# EAGLE design AVR-Pocket-Programmer (EAGLE 6.5.0)
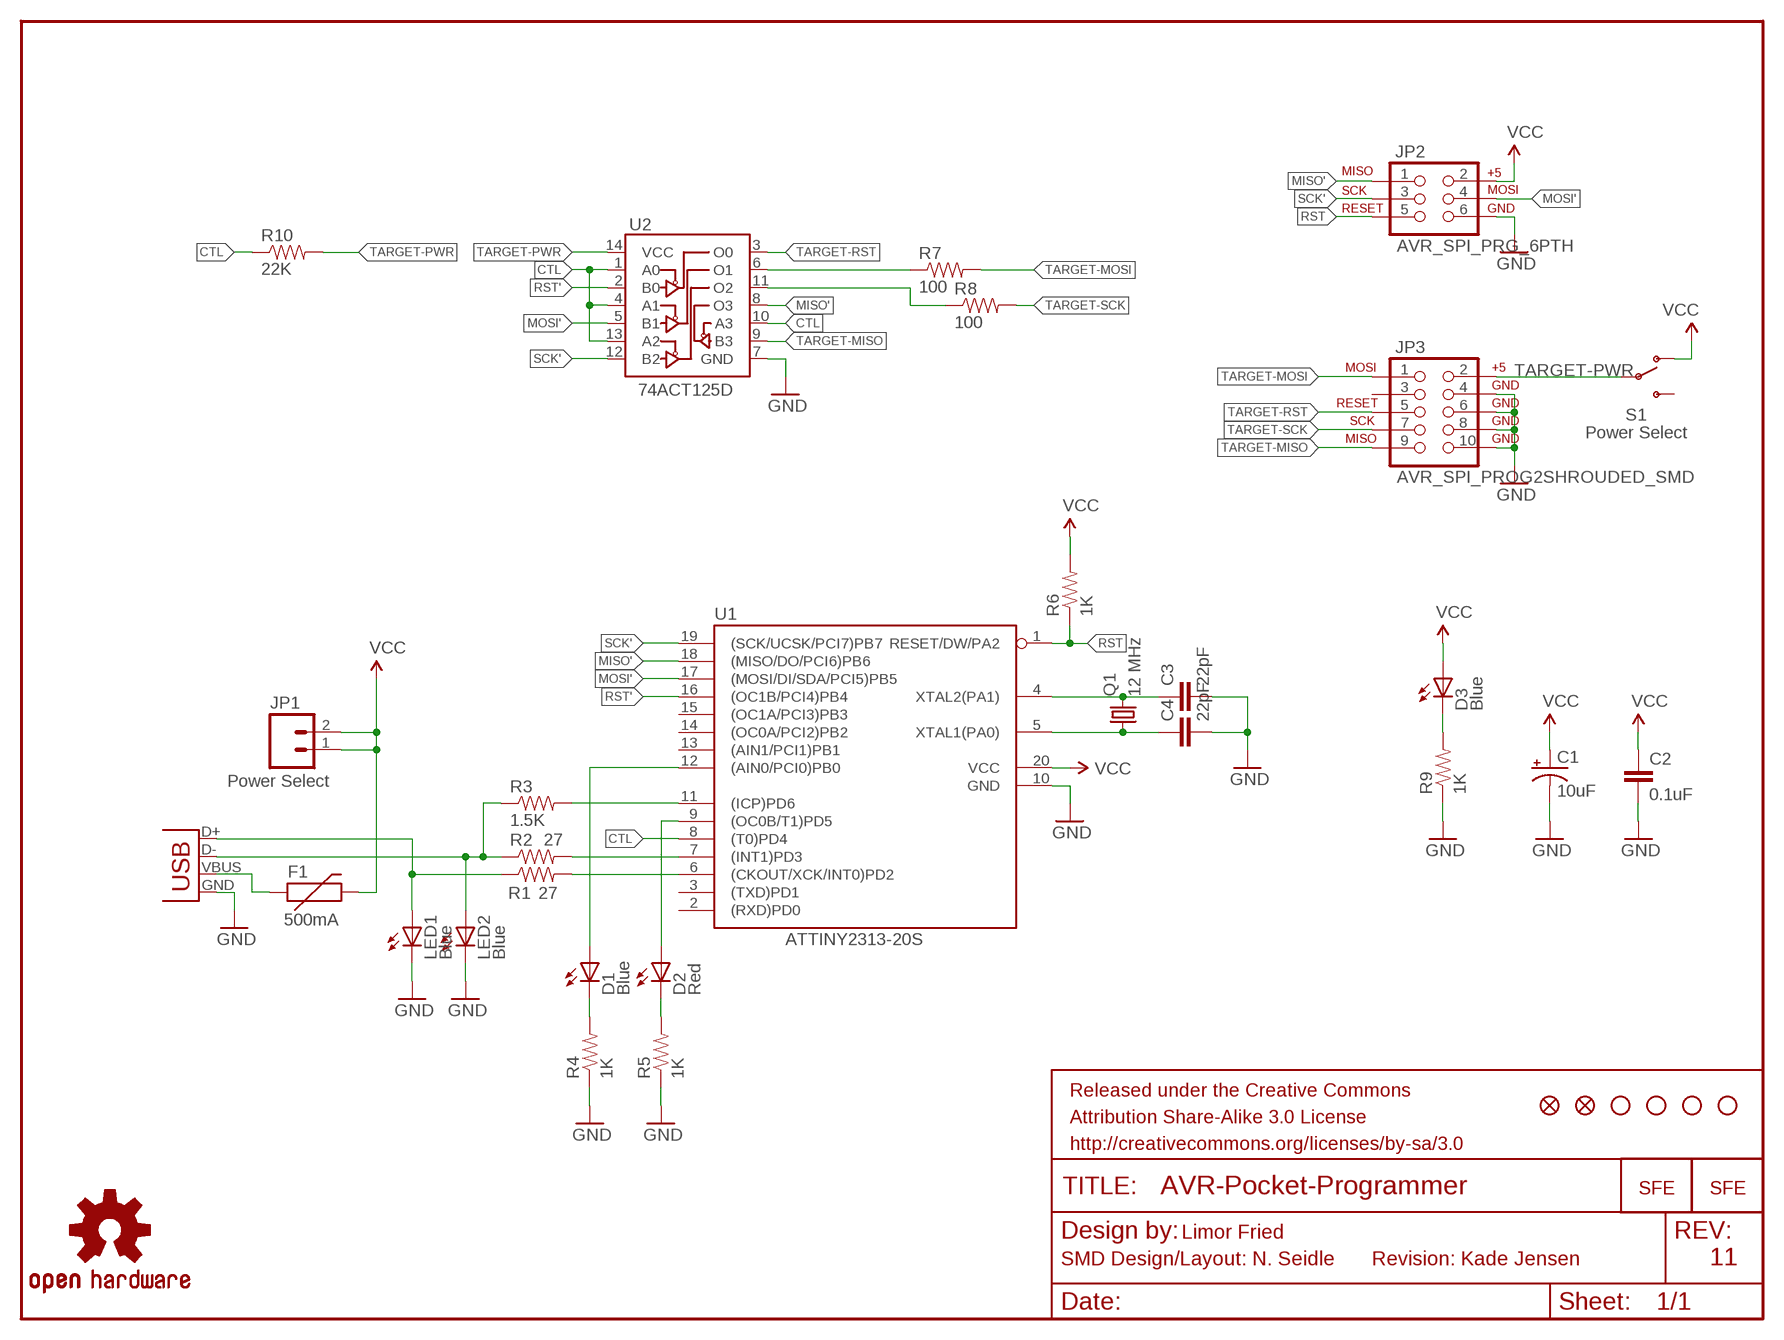
[diagram p0: schematic, sheet 1]

## Parts
C1  10uF  CAP_POL1206  [EIA3216]
C2  0.1uF  CAP0603-CAP  [0603-CAP]
C3  22pF  CAP0603-CAP  [0603-CAP]
C4  22pF  CAP0603-CAP  [0603-CAP]
D1  Blue  LED0603  [LED-0603]
D2  Red  LED0603  [LED-0603]
D3  Blue  LED0603  [LED-0603]
F1  500mA  PTCSMD-W  [PTC-1206-WIDE]
FRAME1  FRAME-LETTER  [CREATIVE_COMMONS]
JP1  Power Select  M02PTH  [1X02]
JP2  AVR_SPI_PRG_6PTH  [2X3]
JP3  AVR_SPI_PROG2SHROUDED_SMD  [2X5-SHROUDED_SMD]
LED1  Blue  LED0603  [LED-0603]
LED2  Blue  LED0603  [LED-0603]
LOGO1  OSHW-LOGOM  [OSHW-LOGO-M]
Q1  12 MHz  CRYSTAL5X3  [CRYSTAL-SMD-5X3]
R1  27  RESISTOR0603-RES  [0603-RES]
R2  27  RESISTOR0603-RES  [0603-RES]
R3  1.5K  RESISTOR0603-RES  [0603-RES]
R4  1K  RESISTOR0603-RES  [0603-RES]
R5  1K  RESISTOR0603-RES  [0603-RES]
R6  1K  RESISTOR0603-RES  [0603-RES]
R7  100  RESISTOR0603-RES  [0603-RES]
R8  100  RESISTOR0603-RES  [0603-RES]
R9  1K  RESISTOR0603-RES  [0603-RES]
R10  22K  RESISTOR0603-RES  [0603-RES]
S1  Power Select  SWITCH-SPSTSMD  [AYZ0202]
U1  ATTINY2313-20S  [SO20L]
U2  74ACT125D  [SO014]
U$1  STAND-OFF  [STAND-OFF]
U$2  LOGO-SFESK  [SFE-LOGO-FLAME]
U$3  STAND-OFF  [STAND-OFF]
U$4  STAND-OFF  [STAND-OFF]
U$5  STAND-OFF  [STAND-OFF]
U$6  FIDUCIAL1X2  [FIDUCIAL-1X2]
U$7  FIDUCIAL1X2  [FIDUCIAL-1X2]
U$8  LOGO-SFENEW  [SFE-NEW-WEBLOGO]
X2  USBSMD  [USB-MINIB]

## Nets
CTL: R10.1 U1.8((T0)PD4) U2.1(A0) U2.4(A1) U2.10(A3) U2.13(A2)
D+: LED1.A R1.1 X2.D+
D-: LED2.A R2.1 R3.1 X2.D-
GND: C1.C(-) C2.2 C3.2 C4.2 JP2.6 JP3.4 JP3.6 JP3.8 JP3.10 LED1.C LED2.C R4.1 R5.1 R9.1 U1.10(GND) U2.7(GND) X2.GND
MISO': JP2.1 U1.18((MISO/DO/PCI6)PB6) U2.8(O3)
MOSI': JP2.4 U1.17((MOSI/DI/SDA/PCI5)PB5) U2.5(B1)
N$1: R3.2 U1.11((ICP)PD6)
N$2: D2.A U1.9((OC0B/T1)PD5)
N$3: D3.C R9.2
N$4: F1.1 X2.VBUS
N$5: C3.1 Q1.3 U1.4(XTAL2(PA1))
N$6: C4.1 Q1.1 U1.5(XTAL1(PA0))
N$17: D1.A U1.12((AIN0/PCI0)PB0)
N$18: D1.C R4.2
N$19: D2.C R5.2
N$22: R7.1 U2.6(O1)
N$25: R8.1 U2.11(O2)
PD+: R1.2 U1.6((CKOUT/XCK/INT0)PD2)
PD-: R2.2 U1.7((INT1)PD3)
RST: JP2.5 R6.1 U1.1(RESET/DW/PA2)
RST': U1.16((OC1B/PCI4)PB4) U2.2(B0)
SCK': JP2.3 U1.19((SCK/UCSK/PCI7)PB7) U2.12(B2)
TARGET-MISO: JP3.9 U2.9(B3)
TARGET-MOSI: JP3.1 R7.2
TARGET-PWR: JP3.2 R10.2 S1.2(P) U2.14(VCC)
TARGET-RST: JP3.5 U2.3(O0)
TARGET-SCK: JP3.7 R8.2
VCC: C1.A(+) C2.1 D3.A F1.2 JP1.1 JP1.2 JP2.2 R6.2 S1.1(O) U1.20(VCC)
Unconnected: JP3.3 S1.3(S) U1.2((RXD)PD0) U1.3((TXD)PD1) U1.13((AIN1/PCI1)PB1) U1.14((OC0A/PCI2)PB2) U1.15((OC1A/PCI3)PB3)

## Notes on the sheet
- Limor Fried
- SMD Design/Layout: N. Seidle | Revision: Kade Jensen | 11

## Library data of the parts
C1 = SparkFun:CAP_POL: Capacitor Polarized These are standard SMD and PTH capacitors. Normally 10uF, 47uF, and 100uF in electrolytic and tantalum varieties. Always verify the external diameter of the through hole cap, it varies with capacity, voltage, and manufacturer. The EIA devices should be standard.
C2-C4 = SparkFun:CAP: Capacitor Standard 0603 ceramic capacitor, and 0.1" leaded capacitor.
D1-D3 LED1 LED2 = SparkFun:LED: LEDs Standard schematic elements and footprints for 5mm, 3mm, 1206, and 0603 sized LEDs. 5mm - Spark Fun Electronics SKU : COM-00529 (and others)
F1 = SparkFun-PowerIC:PTC: Resettable Fuse PTC Resettable Fuse. Spark Fun Electronics SKU : COM-08357
FRAME1 = SparkFun-Aesthetics:FRAME-LETTER: Schematic Frame Standard 8.5x11 US Letter frame
JP1 = SparkFun:M02: Header 2 Standard 2-pin 0.1" header. Use with straight break away headers (SKU : PRT-00116), right angle break away headers (PRT-00553), swiss pins (PRT-00743), machine pins (PRT-00117), and female headers (PRT-00115). Molex polarized connector foot print use with SKU : PRT-08233 with associated crimp pins and housings.
JP2 = SparkFun:AVR_SPI_PRG_6: AVR ISP 6 Pin This is the reduced ISP connector for AVR programming. Common on Arduino. This footprint will take up less PCB space and can be used with a 10-pin to 6-pin adapter such as SKU: BOB-08508
JP3 = SparkFun:AVR_SPI_PROG2: AVR ICSP Header This is the standard AVR In Circuit Serial Programming header. Minimal, but includes pin one indicator. Works with standard Olimex programmers. Also look for the 6-pin reduced version. Spark Fun Electronics SKU: PRT-00778. Note that the Variant "Shrouded_SMD" is an SMD part and will not work with the thru-hole connector.
LOGO1 = SparkFun-Aesthetics:OSHW-LOGO: Open Source Hardware Logo This logo indicates the piece of hardware it is found on incorporates a OSHW license and/or adheres to the definition of open source hardware found here: http://freedomdefined.org/OSHW
Q1 = SparkFun:CRYSTAL: Crystals Various standard crystals. Proven footprints. Spark Fun Electronics SKU : COM-00534
R1-R10 = SparkFun:RESISTOR: Resistor Basic schematic elements and footprints for 0603, 1206, and PTH 1/10th watt (small) resistors.
S1 = SparkFun:SWITCH-SPST: SPST Switch Simple slide switch. Spark Fun Electronics SKU : COM-00102
U1 = avr:ATTINY2313: MICROCONTROLLER 2 Kbytes FLASH 128 bytes SRAM 128 bytes EEPROM USART USI
U2 = SparkFun:74ACT125D: Quad Buffer with 3-State Outputs- ON Semi Conductor: Digikey P/N MC74ACT125DR2GOSTR-ND
U$1 U$3-U$5 = SparkFun:STAND-OFF: Stand Off This is the mechanical footprint for a #4 phillips button head screw. Use the keepout ring to avoid running the screw head into surrounding components. SKU : PRT-00447
U$2 U$8 = SparkFun:LOGO-SFE: Spark Fun Electronics PCB Logo This is the standard Spark Fun Electronics PCB logo.
U$6 U$7 = SparkFun:FIDUCIAL: Fiducial Alignment Points Various fiducial points for machine vision alignment.
X2 = SparkFun:USB: USB Connectors USB-B-PTH is fully proven SKU : PRT-00139 USB-miniB is fully proven SKU : PRT-00587 USB-A-PCB is untested. USB-A-H is throughly reviewed, but untested. Spark Fun Electronics SKU : PRT-00437 USB-B-SMT is throughly reviewed, but untested. Needs silkscreen touching up. USB-A-S has not been used/tested USB-MB-H has not been used/tested

## Net classes
0 default: width 0.203 mm, drill 0.508 mm, clearance 0.203 mm

## Board
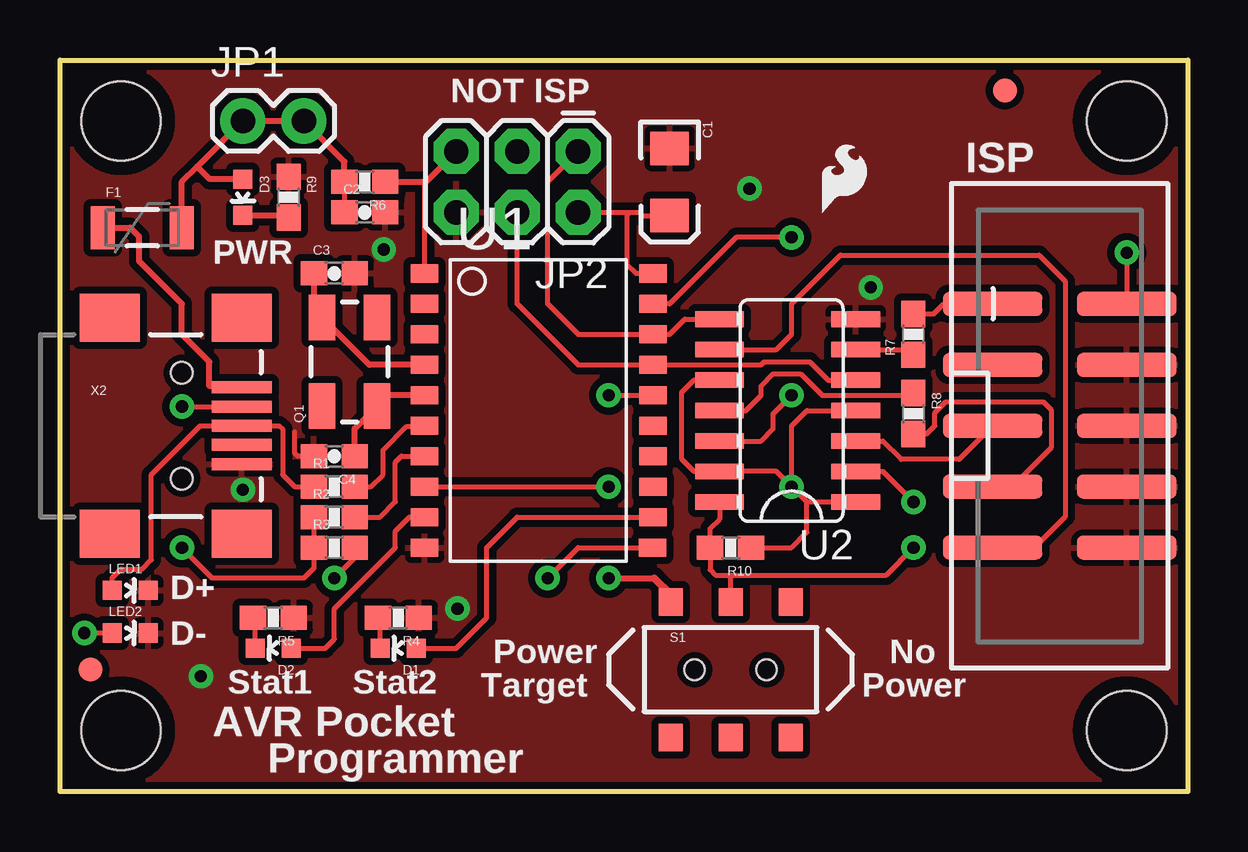
[diagram p1: board, top side]
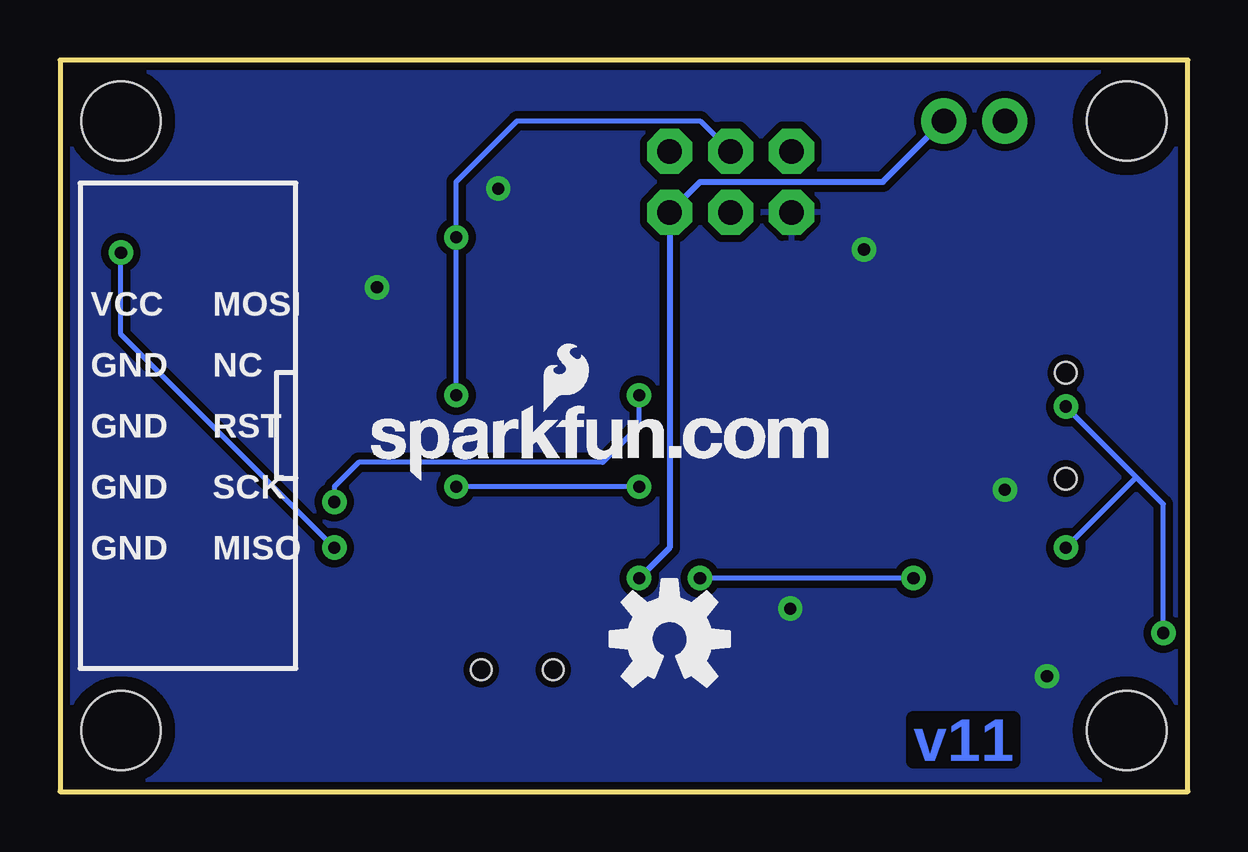
[diagram p2: board, bottom side, seen from below]

Size 46.99 x 30.48 mm. Coordinates in mm from the lower left corner, seen from the top.
Outline: 0,30.48 46.99,30.48 46.99,0 0,0 0,30.48
Copper layers (1*16): Top 0.035mm / dielectric 1.5mm / Bottom 0.035mm
Design rules "SparkFun": minimum track width 8mil, minimum drill 20mil, track to track 8mil, track to pad 8mil, pad to pad 8mil, via to via 8mil, smd to smd 8mil, copper to edge 10mil, drill to drill 8mil, minimum pad ring 12mil, minimum via ring 10mil, stop-mask expansion 4mil, vias tented up to drill 20mil, thermal gap 10mil

### Footprints (pad centres in the part's own frame; a part is rotated, then mirrored left to right if it is on the bottom)
EIA3216 = smd 1.4 x 1.6: A 1.4,0; C -1.4,0
0603-CAP = smd 1.1 x 1: 1 -0.85,0; 2 0.85,0
LED-0603 = smd 0.8 x 0.8: A 0,-0.75; C 0,0.75
PTC-1206-WIDE = smd 1 x 1.8: 1 -1.654,0; 2 1.654,0
1X02 = drill 1.016 pad 1.88: 1 0,0; 2 2.54,0
2X3 = drill 1.016 pad 1.88 octagon: 1 0,0; 2 0,2.54; 3 2.54,0; 4 2.54,2.54; 5 5.08,0; 6 5.08,2.54
2X5-SHROUDED_SMD = smd 4.15 x 1: 1 -2.794,5.08; 2 2.794,5.08; 3 -2.794,2.54; 4 2.794,2.54; 5 -2.794,0; 6 2.794,0; 7 -2.794,-2.54; 8 2.794,-2.54; 9 -2.794,-5.08; 10 2.794,-5.08
CRYSTAL-SMD-5X3 = smd 1.9 x 1.1: 1 -1.85,-1.15; 2 1.85,-1.15; 3 1.85,1.15; 4 -1.85,1.15
0603-RES = smd 1.1 x 1: 1 -0.85,0; 2 0.85,0
AYZ0202 = smd 1 x 1.15: 1 -2.5,2.825; 2 0,2.825; 3 2.5,2.825; 4 -2.5,-2.825; 5 0,-2.825; 6 2.5,-2.825 | hole 0.85: 1.5,0; -1.5,0
SO20L = smd 0.762 x 1.143: 1 -5.08,-5.131; 2 -3.81,-5.131; 3 -2.54,-5.131; 4 -1.27,-5.131; 5 0,-5.131; 6 1.27,-5.131; 7 2.54,-5.131; 8 3.81,-5.131; 9 5.08,-5.131; 10 6.35,-5.131; 11 6.35,4.369; 12 5.08,4.394; 13 3.81,4.394; 14 2.54,4.394; 15 1.27,4.394; 16 0,4.394; 17 -1.27,4.394; 18 -2.54,4.394; 19 -3.81,4.394; 20 -5.08,4.394
SO014 = smd 0.66 x 2.032: 1 -3.175,-2.68; 2 -1.905,-2.68; 3 -0.635,-2.68; 4 0.635,-2.68; 5 1.905,-2.68; 6 3.175,-2.68; 7 4.445,-2.68; 8 4.445,2.997; 9 3.175,2.997; 10 1.905,2.997; 11 0.635,2.997; 12 -0.635,2.997; 13 -1.905,2.997; 14 -3.175,2.997
STAND-OFF = hole 3.302: 0,0
FIDUCIAL-1X2 = smd 1 x 1: 1 0,0
USB-MINIB = smd 2.5 x 0.5: D+ 2.5,0; D- 2.5,0.8; GND 2.5,-1.6; ID 2.5,-0.8; VBUS 2.5,1.6 | smd 2.5 x 2: GND@1 -3,-4.5; GND@2 -3,4.5; GND@3 2.5,4.5; GND@4 2.5,-4.5 | hole 0.9: 0,2.2; 0,-2.2

### Placement (x,y rotation side)
C1  25.4,25.4 270 top
C2  12.7,24.13 0 top
C3  11.43,21.59 0 top
C4  11.43,13.97 180 top
D1  14.1,5.97 90 top
D2  8.89,5.97 90 top
D3  7.62,24.77 180 top
F1  3.43,23.5 0 top
FRAME1  1.27,-11.43 0 top  (outside the outline)
JP1  7.62,27.94 0 top
JP2  21.59,26.67 180 top
JP3  41.66,15.24 0 top
LED1  2.92,8.38 270 top
LED2  2.92,6.6 270 top
LOGO1  21.59,6.35 0 bottom
Q1  12.06,17.91 90 top
R1  11.43,12.7 0 top
R2  11.43,11.43 0 top
R3  11.43,10.16 0 top
R4  14.1,7.24 180 top
R5  8.89,7.24 180 top
R6  12.7,25.4 180 top
R7  35.56,19.05 90 top
R8  35.56,15.75 270 top
R9  9.53,24.77 270 top
R10  27.94,10.16 180 top
S1  27.94,5.08 0 top
U1  20.32,16.51 270 top
U2  30.48,15.24 90 top
U$1  2.54,2.54 0 top
U$2  31.75,24.13 0 top
U$3  2.54,27.94 0 top
U$4  44.45,27.94 0 top
U$5  44.45,2.54 0 top
U$6  1.27,5.08 0 top
U$7  39.37,29.21 0 top
U$8  34.04,12.95 0 bottom
X2  5.08,15.24 0 top

### Tracks (layer width: path | path; a pad name or v marks a point on that pad's centre or on a via)
CTL  (via drill 0.51)
  Top 0.203: 31.11,12.06 U2.1 | v30.48,12.7 29.84,13.34 U2.13 26.42,13.34 25.91,13.84 25.91,16.64 26.42,17.14 U2.10 | v30.48,12.7 31.11,12.06 | U2.4 31.11,15.88 30.48,15.24 v30.48,12.7 | U1.8 v22.86,12.7 | R10.1 30.48,10.16 31.11,10.79 31.11,12.06
  Bottom 0.203: v22.86,12.7 v30.48,12.7
D+
  Top 0.203: LED1.A 2.17,8.9 2.54,9.27 3.43,9.27 3.81,9.65 3.81,13.21 5.84,15.24 X2.D+ 9.14,15.24 9.27,15.11 9.27,13.21 9.78,12.7 R1.1
D-  (via drill 0.51)
  Top 0.203: 10.92,11.57 R2.1 R3.1 10.58,9.31 10.16,8.89 6.35,8.89 v5.08,10.16 | v5.08,16.04 X2.D- | LED2.A v1.02,6.6
  Bottom 0.203: 5.08,16 v5.08,16.04 2.14,13.1 | 2.14,13.1 1.02,11.98 v1.02,6.6 | 2.14,13.1 v5.08,10.16
GND  (via drill 0.51)
  Top 0.203: C4.2 9.91,13.97 9.78,14.1 9.78,14.99
  other vias: 13.49,22.58 28.73,25.12 33.78,21.01 16.56,7.62 5.87,4.8 7.62,12.57
  pour Top (isolate 0.305): 0,0 0,30.48 46.99,30.48 46.99,0
  pour Bottom (isolate 0.305): 0,0 0,30.48 46.99,30.48 46.99,0
MISO'
  Top 0.203: JP2.1 20.32,25.4 20.32,20.32 21.59,19.05 U1.18 25.4,19.05 26.04,19.68 U2.8
MOSI'
  Top 0.203: JP2.4 19.05,20.32 21.59,17.78 U1.17 29.21,17.78 29.34,17.91 31.24,17.91 32,17.14 U2.5
N$1  (via drill 0.51)
  Top 0.203: v20.32,8.89 21.59,10.16 U1.11 | R3.2 12.28,9.74 v11.43,8.89
  Bottom 0.203: v11.43,8.89 v20.32,8.89
N$2
  Top 0.203: 15.19,11.38 U1.9 14.55,11.43 13.97,10.85 13.97,10.16 11.43,7.62 11.43,6.35 11.05,5.97 D2.A
N$3
  Top 0.254: D3.C 9.43,24.02 R9.2
N$4
  Top 0.203: X2.VBUS 7.53,16.89
  Top 0.254: X2.VBUS 7.29,16.84 | 7.53,16.89 6.22,16.89 6.22,17.91 5.08,19.05 5.08,20.32 3.3,22.1 3.3,23.11 2.92,23.5 F1.1
N$5
  Top 0.254: C3.1 10.58,20.09 Q1.3 12.89,17.78 U1.4
N$6
  Top 0.254: U1.5 13.67,16.51 Q1.1 12.28,15.12 C4.1
N$17
  Top 0.203: U1.12 19.05,11.43 17.78,10.16 17.78,7.24 16.51,5.97 D1.A
N$18
  Top 0.203: D1.C 13.35,7.14 R4.2
N$19
  Top 0.203: D2.C 8.14,7.14 R5.2
N$22
  Top 0.203: U2.6 35.34,18.41 R7.1
N$25
  Top 0.203: U2.11 28.57,15.88 29.21,16.51 29.21,16.89 29.72,17.4 30.86,17.4 31.75,16.51 35.47,16.51 R8.1
PD+
  Top 0.203: U1.6 15.16,15.21 14.45,15.21 13.46,14.22 13.46,13.21 12.95,12.7 R1.2
PD-
  Top 0.203: U1.7 14.22,13.97 13.97,13.72 13.97,12.06 13.34,11.43 R2.2
RST
  Top 0.203: U1.1 15.19,25.35 15.14,25.4
  Top 0.254: 15.19,25.35 JP2.5 | R6.1 15.14,25.4
RST'  (via drill 0.51)
  Top 0.203: v22.86,16.51 U1.16 | U2.2 34.29,13.34 v35.56,12.06
  Bottom 0.203: v22.86,16.51 22.86,15.24 24.38,13.72 34.54,13.72 35.56,12.7 v35.56,12.06
SCK'  (via drill 0.51)
  Top 0.203: U1.19 25.4,20.32 28.17,23.09 v30.48,23.09 | U2.12 29.21,14.61 29.72,15.11 29.72,15.75 v30.48,16.51
  Bottom 0.203: v30.48,16.51 v30.48,23.09 30.48,25.4 27.94,27.94 20.32,27.94 JP2.3
TARGET-MISO
  Top 0.203: U2.9 29.84,18.41 30.48,19.05 30.48,20.32 32.51,22.35 40.79,22.35 41.88,21.26 41.88,11.46 40.59,10.16 JP3.9
TARGET-MOSI
  Top 0.203: R7.2 36.41,19.9 36.83,20.32 JP3.1
TARGET-PWR  (via drill 0.51)
  Top 0.203: 28.1,7.91 S1.2 27.94,9.02 | 27.94,9.02 27.3,9.02 27.09,9.23 R10.2 27.09,10.96 27.48,11.35 U2.14 | 27.94,9.02 34.42,9.02 v35.56,10.16 | v44.45,22.45 JP3.2
  Bottom 0.203: v35.56,10.16 44.45,19.05 v44.45,22.45
TARGET-RST
  Top 0.203: JP3.5 37.47,13.84 35.05,13.84 34.29,14.61 U2.3
TARGET-SCK
  Top 0.203: JP3.7 39.67,12.7 41.3,14.33 41.3,15.9 40.97,16.23 36.91,16.23 36.45,15.77 36.45,15.24 36.11,14.9 R8.2
VCC  (via drill 0.51)
  Top 0.203: C1.A 24.26,24 24.13,24.13 23.75,24.13 | JP2.2 23.75,24.13 | U1.20 24,21.59 23.62,21.97 23.62,24 23.75,24.13 | R6.2 C2.1
  Top 0.254: v22.86,8.89 24.77,8.89 | F1.2 5.08,25.4 5.71,26.04 | 5.71,26.04 JP1.1 JP1.2 11.85,26.25 R6.2 | D3.A 6.24,25.52 5.71,26.04
  Top 0.305: S1.1 25.44,8.21 24.77,8.89
  Bottom 0.254: v22.86,8.89 21.59,10.16 JP2.2 20.32,25.4 12.7,25.4 JP1.2

### Text on the board
Bottom: v11
tPlace: NOT ISP | ISP | PWR | D+ | D- | Power | No | Stat1 | Stat2 | Target | Power | AVR Pocket | Programmer
bPlace: MOSI | VCC | NC | GND | RST | GND | SCK | GND | MISO | GND
Document: Limor Fried | SMD Design/Layout: N. Seidle
tDocu: Limor Fried | SMD Design: N. Seidle | Revision: Kade Jensen